# Altium schematic sheet RK_3399_RGMII_SDIO_SPI_GPIO_and_Others.SchDoc
size A3; SheetNumber: 11; SheetTotal: 19
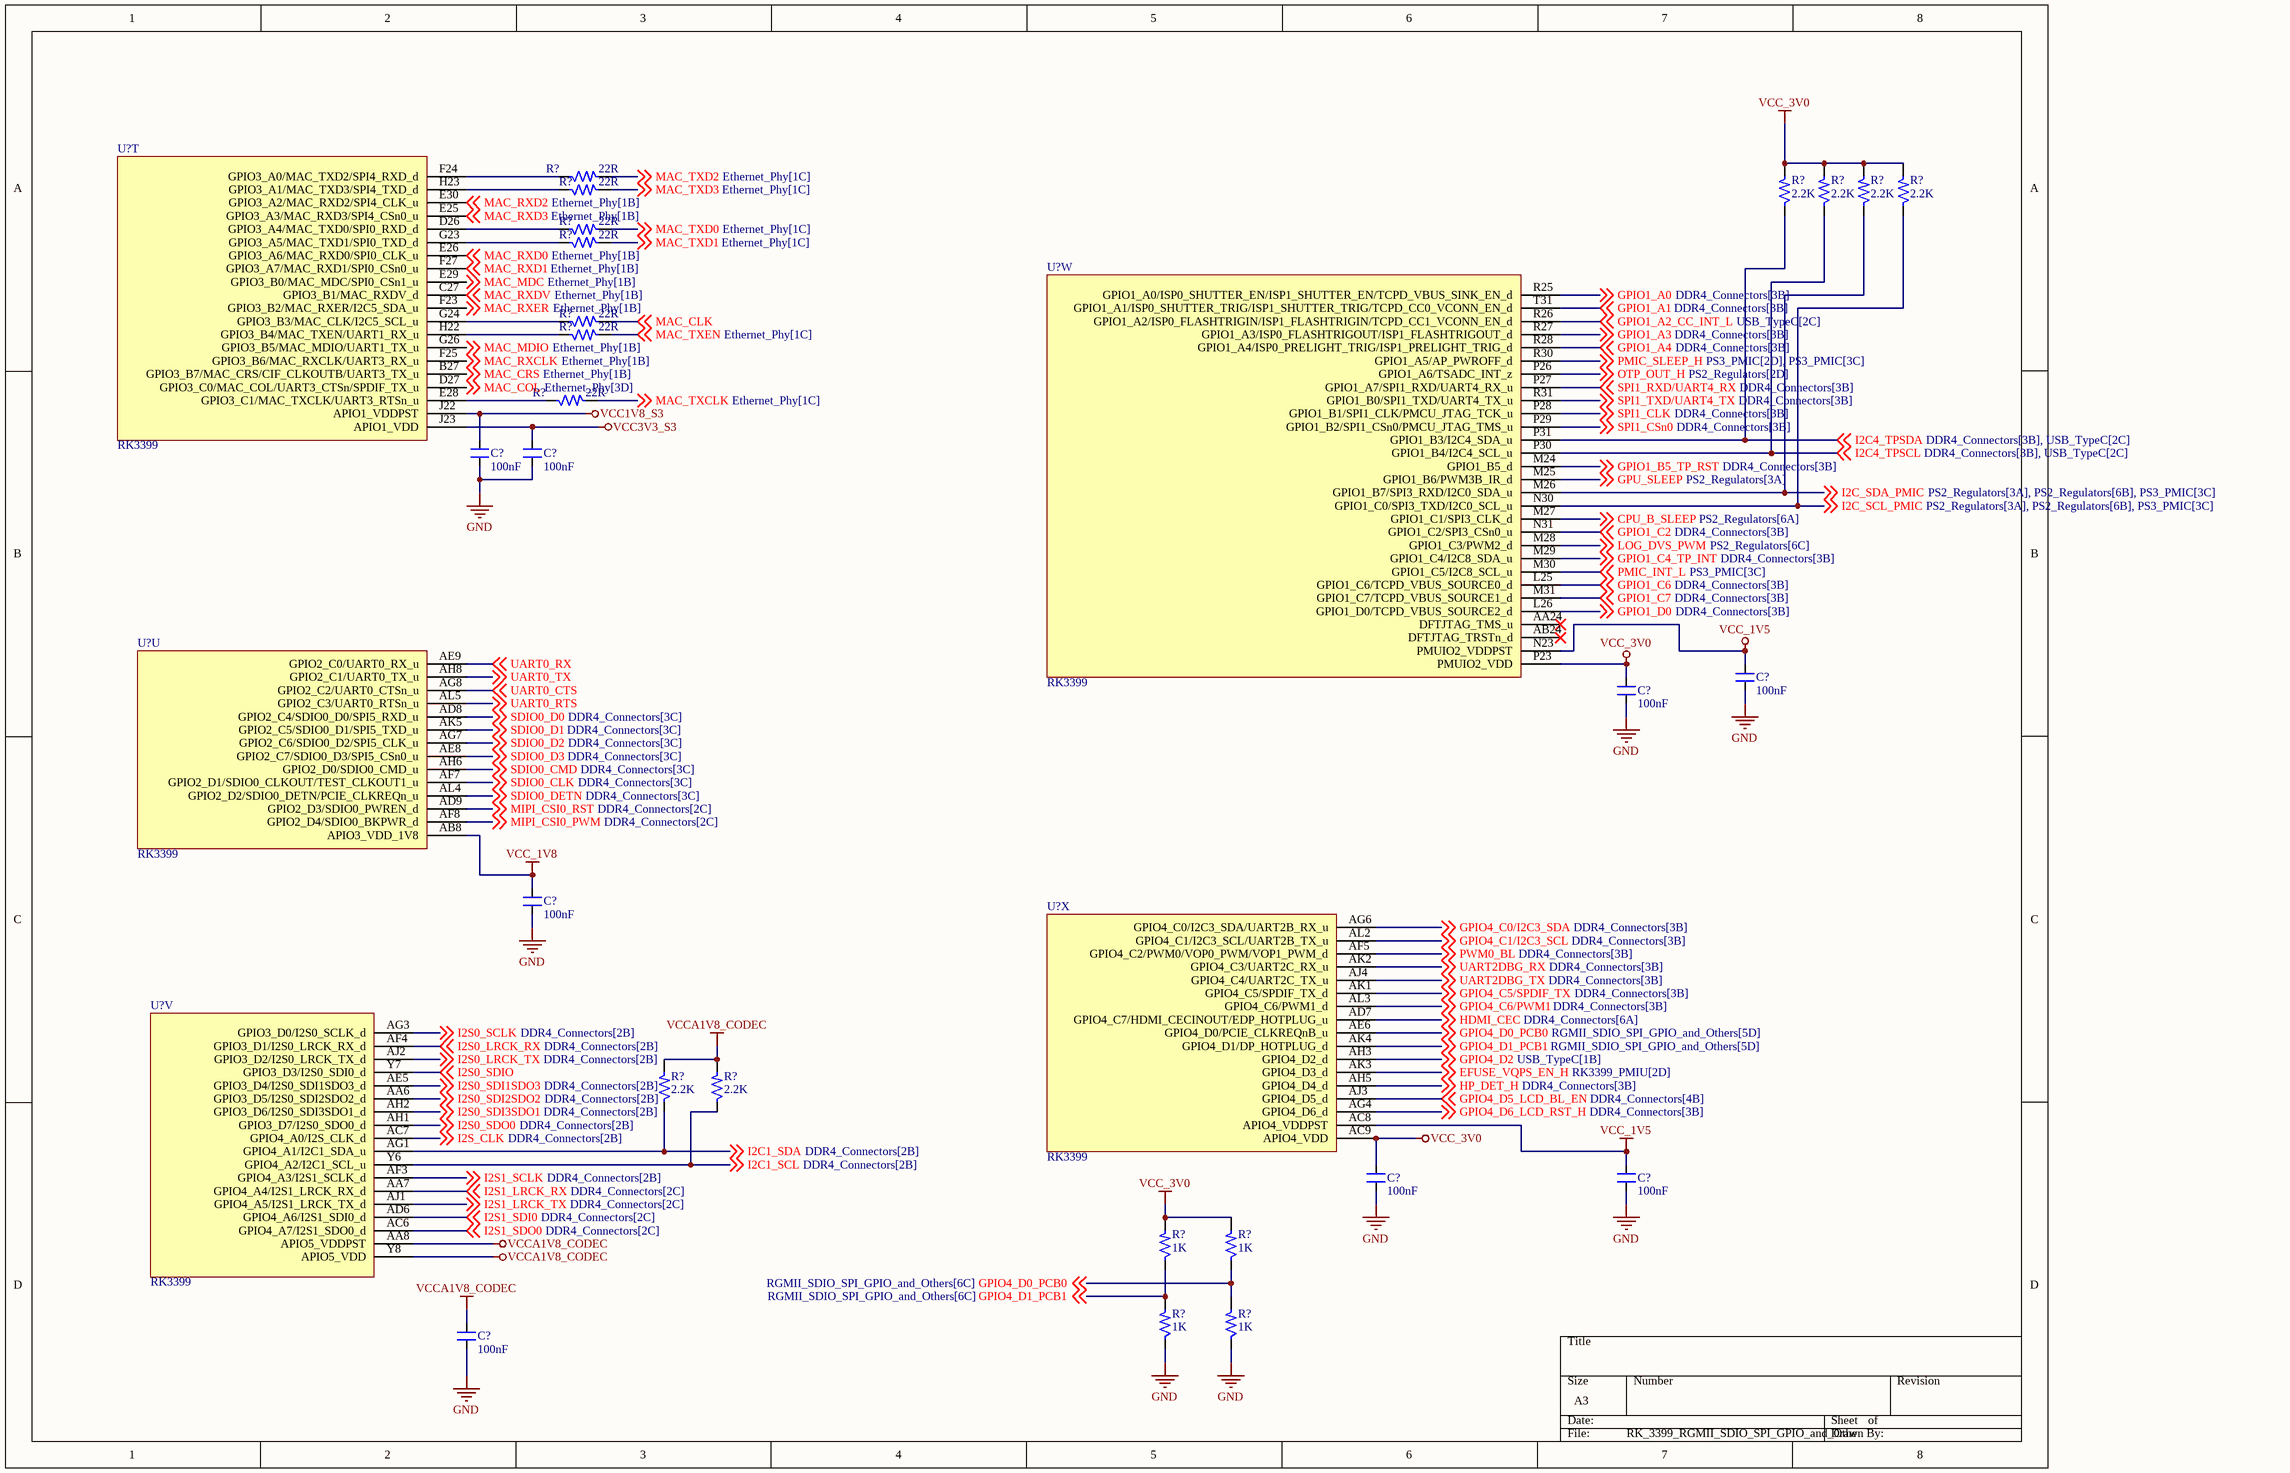
[diagram p0: RK_3399_RGMII_SDIO_SPI_GPIO_and_Others.SchDoc]

## Parts
(Parts that share a designator on the sheet are numbered #1, #2 ... from top to bottom, then left to right.)
C?#1  100nF  [CAP_0201]
C?#2  100nF  [CAP_0201]
C?#3  100nF  [CAP_0201]
C?#4  100nF  [CAP_0201]
C?#5  100nF  [CAP_0201]
C?#6  100nF  [CAP_0201]
C?#7  100nF  [CAP_0201]
C?#8  100nF  [CAP_0201]
R?#1  22R  [RES_0201]
R?#2  22R  [RES_0201]
R?#3  2.2K  [RES_0201]
R?#4  2.2K  [RES_0201]
R?#5  2.2K  [RES_0201]
R?#6  2.2K  [RES_0201]
R?#7  22R  [RES_0201]
R?#8  22R  [RES_0201]
R?#9  22R  [RES_0201]
R?#10  22R  [RES_0201]
R?#11  22R  [RES_0201]
R?#12  2.2K  [RES_0201]
R?#13  2.2K  [RES_0201]
R?#14  1K  [RES_0201]
R?#15  1K  [RES_0201]
R?#16  1K  [RES_0201]
R?#17  1K  [RES_0201]
U?#1  RK3399  [FBGA828_23_826X826]  (part T of 24)
U?#2  RK3399  [FBGA828_23_826X826]  (part W of 24)
U?#3  RK3399  [FBGA828_23_826X826]  (part U of 24)
U?#4  RK3399  [FBGA828_23_826X826]  (part X of 24)
U?#5  RK3399  [FBGA828_23_826X826]  (part V of 24)

## Nets
GND: C?#1.1 C?#2.1 C?#3.1 C?#4.1 C?#5.1 C?#6.1 C?#7.1 C?#8.1 R?#16.1 R?#17.1
VCC1V8_S3: C?#1.2 U?#1.J22(APIO1_VDDPST)
VCC3V3_S3: C?#2.2 U?#1.J23(APIO1_VDD)
VCC_1V5: C?#3.2 C?#7.2 U?#2.N23(PMUIO2_VDDPST) U?#4.AC8(APIO4_VDDPST)
VCC_1V8: C?#5.2 U?#3.AB8(APIO3_VDD_1V8)
VCC_3V0: C?#4.2 C?#6.2 R?#3.2 R?#4.2 R?#5.2 R?#6.2 R?#14.2 R?#15.2 U?#2.P23(PMUIO2_VDD) U?#4.AC9(APIO4_VDD)
VCCA1V8_CODEC: C?#8.2 R?#12.2 R?#13.2 U?#5.AA8(APIO5_VDDPST) U?#5.Y8(APIO5_VDD)
CPU_B_SLEEP: U?#2.M27(GPIO1_C1/SPI3_CLK_d) ; off-sheet CPU_B_SLEEP
EFUSE_VQPS_EN_H: U?#4.AK3(GPIO4_D3_d) ; off-sheet EFUSE_VQPS_EN_H
GPIO1_A0: U?#2.R25(GPIO1_A0/ISP0_SHUTTER_EN/ISP1_SHUTTER_EN/TCPD_VBUS_SINK_EN_d) ; off-sheet GPIO1_A0
GPIO1_A1: U?#2.T31(GPIO1_A1/ISP0_SHUTTER_TRIG/ISP1_SHUTTER_TRIG/TCPD_CC0_VCONN_EN_d) ; off-sheet GPIO1_A1
GPIO1_A2_CC_INT_L: U?#2.R26(GPIO1_A2/ISP0_FLASHTRIGIN/ISP1_FLASHTRIGIN/TCPD_CC1_VCONN_EN_d) ; off-sheet GPIO1_A2_CC_INT_L
GPIO1_A3: U?#2.R27(GPIO1_A3/ISP0_FLASHTRIGOUT/ISP1_FLASHTRIGOUT_d) ; off-sheet GPIO1_A3
GPIO1_A4: U?#2.R28(GPIO1_A4/ISP0_PRELIGHT_TRIG/ISP1_PRELIGHT_TRIG_d) ; off-sheet GPIO1_A4
GPIO1_B5_TP_RST: U?#2.M24(GPIO1_B5_d) ; off-sheet GPIO1_B5_TP_RST
GPIO1_C2: U?#2.N31(GPIO1_C2/SPI3_CSn0_u) ; off-sheet GPIO1_C2
GPIO1_C4_TP_INT: U?#2.M29(GPIO1_C4/I2C8_SDA_u) ; off-sheet GPIO1_C4_TP_INT
GPIO1_C6: U?#2.L25(GPIO1_C6/TCPD_VBUS_SOURCE0_d) ; off-sheet GPIO1_C6
GPIO1_C7: U?#2.M31(GPIO1_C7/TCPD_VBUS_SOURCE1_d) ; off-sheet GPIO1_C7
GPIO1_D0: U?#2.L26(GPIO1_D0/TCPD_VBUS_SOURCE2_d) ; off-sheet GPIO1_D0
GPIO4_C0/I2C3_SDA: U?#4.AG6(GPIO4_C0/I2C3_SDA/UART2B_RX_u) ; off-sheet GPIO4_C0/I2C3_SDA
GPIO4_C1/I2C3_SCL: U?#4.AL2(GPIO4_C1/I2C3_SCL/UART2B_TX_u) ; off-sheet GPIO4_C1/I2C3_SCL
GPIO4_C5/SPDIF_TX: U?#4.AK1(GPIO4_C5/SPDIF_TX_d) ; off-sheet GPIO4_C5/SPDIF_TX
GPIO4_C6/PWM1: U?#4.AL3(GPIO4_C6/PWM1_d) ; off-sheet GPIO4_C6/PWM1
GPIO4_D0_PCB0: R?#15.1 R?#17.2 U?#4.AE6(GPIO4_D0/PCIE_CLKREQnB_u) ; off-sheet GPIO4_D0_PCB0
GPIO4_D1_PCB1: R?#14.1 R?#16.2 U?#4.AK4(GPIO4_D1/DP_HOTPLUG_d) ; off-sheet GPIO4_D1_PCB1
GPIO4_D2: U?#4.AH3(GPIO4_D2_d) ; off-sheet GPIO4_D2
GPIO4_D5_LCD_BL_EN: U?#4.AJ3(GPIO4_D5_d) ; off-sheet GPIO4_D5_LCD_BL_EN
GPIO4_D6_LCD_RST_H: U?#4.AG4(GPIO4_D6_d) ; off-sheet GPIO4_D6_LCD_RST_H
GPU_SLEEP: U?#2.M25(GPIO1_B6/PWM3B_IR_d) ; off-sheet GPU_SLEEP
HDMI_CEC: U?#4.AD7(GPIO4_C7/HDMI_CECINOUT/EDP_HOTPLUG_u) ; off-sheet HDMI_CEC
HP_DET_H: U?#4.AH5(GPIO4_D4_d) ; off-sheet HP_DET_H
I2C1_SCL: R?#13.1 U?#5.Y6(GPIO4_A2/I2C1_SCL_u) ; off-sheet I2C1_SCL
I2C1_SDA: R?#12.1 U?#5.AG1(GPIO4_A1/I2C1_SDA_u) ; off-sheet I2C1_SDA
I2C4_TPSCL: R?#4.1 U?#2.P30(GPIO1_B4/I2C4_SCL_u) ; off-sheet I2C4_TPSCL
I2C4_TPSDA: R?#3.1 U?#2.P31(GPIO1_B3/I2C4_SDA_u) ; off-sheet I2C4_TPSDA
I2C_SCL_PMIC: R?#6.1 U?#2.N30(GPIO1_C0/SPI3_TXD/I2C0_SCL_u) ; off-sheet I2C_SCL_PMIC
I2C_SDA_PMIC: R?#5.1 U?#2.M26(GPIO1_B7/SPI3_RXD/I2C0_SDA_u) ; off-sheet I2C_SDA_PMIC
I2S0_LRCK_RX: U?#5.AF4(GPIO3_D1/I2S0_LRCK_RX_d) ; off-sheet I2S0_LRCK_RX
I2S0_LRCK_TX: U?#5.AJ2(GPIO3_D2/I2S0_LRCK_TX_d) ; off-sheet I2S0_LRCK_TX
I2S0_SCLK: U?#5.AG3(GPIO3_D0/I2S0_SCLK_d) ; off-sheet I2S0_SCLK
I2S0_SDI1SDO3: U?#5.AE5(GPIO3_D4/I2S0_SDI1SDO3_d) ; off-sheet I2S0_SDI1SDO3
I2S0_SDI2SDO2: U?#5.AA6(GPIO3_D5/I2S0_SDI2SDO2_d) ; off-sheet I2S0_SDI2SDO2
I2S0_SDI3SDO1: U?#5.AH2(GPIO3_D6/I2S0_SDI3SDO1_d) ; off-sheet I2S0_SDI3SDO1
I2S0_SDIO: U?#5.Y7(GPIO3_D3/I2S0_SDI0_d) ; off-sheet I2S0_SDIO
I2S0_SDO0: U?#5.AH1(GPIO3_D7/I2S0_SDO0_d) ; off-sheet I2S0_SDO0
I2S1_LRCK_RX: U?#5.AA7(GPIO4_A4/I2S1_LRCK_RX_d) ; off-sheet I2S1_LRCK_RX
I2S1_LRCK_TX: U?#5.AJ1(GPIO4_A5/I2S1_LRCK_TX_d) ; off-sheet I2S1_LRCK_TX
I2S1_SCLK: U?#5.AF3(GPIO4_A3/I2S1_SCLK_d) ; off-sheet I2S1_SCLK
I2S1_SDI0: U?#5.AD6(GPIO4_A6/I2S1_SDI0_d) ; off-sheet I2S1_SDI0
I2S1_SDO0: U?#5.AC6(GPIO4_A7/I2S1_SDO0_d) ; off-sheet I2S1_SDO0
I2S_CLK: U?#5.AC7(GPIO4_A0/I2S_CLK_d) ; off-sheet I2S_CLK
LOG_DVS_PWM: U?#2.M28(GPIO1_C3/PWM2_d) ; off-sheet LOG_DVS_PWM
MAC_CLK: R?#9.2 ; off-sheet MAC_CLK
MAC_COL: U?#1.D27(GPIO3_C0/MAC_COL/UART3_CTSn/SPDIF_TX_u) ; off-sheet MAC_COL
MAC_CRS: U?#1.B27(GPIO3_B7/MAC_CRS/CIF_CLKOUTB/UART3_TX_u) ; off-sheet MAC_CRS
MAC_MDC: U?#1.E29(GPIO3_B0/MAC_MDC/SPI0_CSn1_u) ; off-sheet MAC_MDC
MAC_MDIO: U?#1.G26(GPIO3_B5/MAC_MDIO/UART1_TX_u) ; off-sheet MAC_MDIO
MAC_RXCLK: U?#1.F25(GPIO3_B6/MAC_RXCLK/UART3_RX_u) ; off-sheet MAC_RXCLK
MAC_RXD0: U?#1.E26(GPIO3_A6/MAC_RXD0/SPI0_CLK_u) ; off-sheet MAC_RXD0
MAC_RXD1: U?#1.F27(GPIO3_A7/MAC_RXD1/SPI0_CSn0_u) ; off-sheet MAC_RXD1
MAC_RXD2: U?#1.E30(GPIO3_A2/MAC_RXD2/SPI4_CLK_u) ; off-sheet MAC_RXD2
MAC_RXD3: U?#1.E25(GPIO3_A3/MAC_RXD3/SPI4_CSn0_u) ; off-sheet MAC_RXD3
MAC_RXDV: U?#1.C27(GPIO3_B1/MAC_RXDV_d) ; off-sheet MAC_RXDV
MAC_RXER: U?#1.F23(GPIO3_B2/MAC_RXER/I2C5_SDA_u) ; off-sheet MAC_RXER
MAC_TXCLK: R?#11.2 ; off-sheet MAC_TXCLK
MAC_TXD0: R?#7.2 ; off-sheet MAC_TXD0
MAC_TXD1: R?#8.2 ; off-sheet MAC_TXD1
MAC_TXD2: R?#1.2 ; off-sheet MAC_TXD2
MAC_TXD3: R?#2.2 ; off-sheet MAC_TXD3
MAC_TXEN: R?#10.2 ; off-sheet MAC_TXEN
MIPI_CSI0_PWM: U?#3.AF8(GPIO2_D4/SDIO0_BKPWR_d) ; off-sheet MIPI_CSI0_PWM
MIPI_CSI0_RST: U?#3.AD9(GPIO2_D3/SDIO0_PWREN_d) ; off-sheet MIPI_CSI0_RST
OTP_OUT_H: U?#2.P26(GPIO1_A6/TSADC_INT_z) ; off-sheet OTP_OUT_H
PMIC_INT_L: U?#2.M30(GPIO1_C5/I2C8_SCL_u) ; off-sheet PMIC_INT_L
PMIC_SLEEP_H: U?#2.R30(GPIO1_A5/AP_PWROFF_d) ; off-sheet PMIC_SLEEP_H
PWM0_BL: U?#4.AF5(GPIO4_C2/PWM0/VOP0_PWM/VOP1_PWM_d) ; off-sheet PWM0_BL
SDIO0_CLK: U?#3.AF7(GPIO2_D1/SDIO0_CLKOUT/TEST_CLKOUT1_u) ; off-sheet SDIO0_CLK
SDIO0_CMD: U?#3.AH6(GPIO2_D0/SDIO0_CMD_u) ; off-sheet SDIO0_CMD
SDIO0_D0: U?#3.AD8(GPIO2_C4/SDIO0_D0/SPI5_RXD_u) ; off-sheet SDIO0_D0
SDIO0_D1: U?#3.AK5(GPIO2_C5/SDIO0_D1/SPI5_TXD_u) ; off-sheet SDIO0_D1
SDIO0_D2: U?#3.AG7(GPIO2_C6/SDIO0_D2/SPI5_CLK_u) ; off-sheet SDIO0_D2
SDIO0_D3: U?#3.AE8(GPIO2_C7/SDIO0_D3/SPI5_CSn0_u) ; off-sheet SDIO0_D3
SDIO0_DETN: U?#3.AL4(GPIO2_D2/SDIO0_DETN/PCIE_CLKREQn_u) ; off-sheet SDIO0_DETN
SPI1_CLK: U?#2.P28(GPIO1_B1/SPI1_CLK/PMCU_JTAG_TCK_u) ; off-sheet SPI1_CLK
SPI1_CSn0: U?#2.P29(GPIO1_B2/SPI1_CSn0/PMCU_JTAG_TMS_u) ; off-sheet SPI1_CSn0
SPI1_RXD/UART4_RX: U?#2.P27(GPIO1_A7/SPI1_RXD/UART4_RX_u) ; off-sheet SPI1_RXD/UART4_RX
SPI1_TXD/UART4_TX: U?#2.R31(GPIO1_B0/SPI1_TXD/UART4_TX_u) ; off-sheet SPI1_TXD/UART4_TX
UART0_CTS: U?#3.AG8(GPIO2_C2/UART0_CTSn_u) ; off-sheet UART0_CTS
UART0_RTS: U?#3.AL5(GPIO2_C3/UART0_RTSn_u) ; off-sheet UART0_RTS
UART0_RX: U?#3.AE9(GPIO2_C0/UART0_RX_u) ; off-sheet UART0_RX
UART0_TX: U?#3.AH8(GPIO2_C1/UART0_TX_u) ; off-sheet UART0_TX
UART2DBG_RX: U?#4.AK2(GPIO4_C3/UART2C_RX_u) ; off-sheet UART2DBG_RX
UART2DBG_TX: U?#4.AJ4(GPIO4_C4/UART2C_TX_u) ; off-sheet UART2DBG_TX
NetR?#1_1: R?#1.1 U?#1.F24(GPIO3_A0/MAC_TXD2/SPI4_RXD_d)
NetR?#2_1: R?#2.1 U?#1.H23(GPIO3_A1/MAC_TXD3/SPI4_TXD_d)
NetR?#7_1: R?#7.1 U?#1.D26(GPIO3_A4/MAC_TXD0/SPI0_RXD_d)
NetR?#8_1: R?#8.1 U?#1.G23(GPIO3_A5/MAC_TXD1/SPI0_TXD_d)
NetR?#9_1: R?#9.1 U?#1.G24(GPIO3_B3/MAC_CLK/I2C5_SCL_u)
NetR?#10_1: R?#10.1 U?#1.H22(GPIO3_B4/MAC_TXEN/UART1_RX_u)
NetR?#11_1: R?#11.1 U?#1.E28(GPIO3_C1/MAC_TXCLK/UART3_RTSn_u)

Not connected (* = marked no-connect by the designer): U?#2 AA24(DFTJTAG_TMS_u)* AB24(DFTJTAG_TRSTn_d)*

## Library data of the parts
C?#1-C?#8 = CAP_100nF-25V-10%-0201: 0.1µF ±10% 25V Ceramic Capacitor X5R 0201 (0603 Metric); Manufacturer: TDK Corporation; Manufacturer Part Number: C0603X5R1E104K030BB; Case/Package: 0201; Supplier-1: Digikey
R?#1 R?#2 R?#7-R?#11 = RES_22R-0.05W-1%-0201: 22 Ohms ±1% 0.05W, 1/20W Chip Resistor 0201 (0603 Metric) Moisture Resistant Thick Film; Manufacturer: Yageo; Manufacturer Part Number: RC0201FR-0722RL; Case/Package: 0201; Supplier-1: Digikey
R?#3-R?#6 R?#12 R?#13 = RES_2.2K-0.05W-1%-0201: 2.2 kOhms ±1% 0.05W, 1/20W Chip Resistor 0201 (0603 Metric) Thick Film; Manufacturer: Stackpole Electronics Inc; Manufacturer Part Number: RMCF0201FT2K20; Case/Package: 0201; Supplier-1: Digikey
R?#14-R?#17 = RES_1K-0.05W-1%-0201: 1 kOhms ±1% 0.05W, 1/20W Chip Resistor 0201 (0603 Metric) Thick Film; Manufacturer: Yageo; Manufacturer Part Number: RC0201FR-071KL; Case/Package: 0201; Supplier-1: Digikey
U?#1-U?#5 = IC_RK3399-FCBGA828: RK3399 is a low power, high performance processor for computing, personal mobile.; Manufacturer: Rockchip; Manufacturer Part Number: RK3399; Case/Package: FCBGA828; Supplier-1: Rockchip